# EAGLE design TLE5010 (EAGLE 7.5.0)
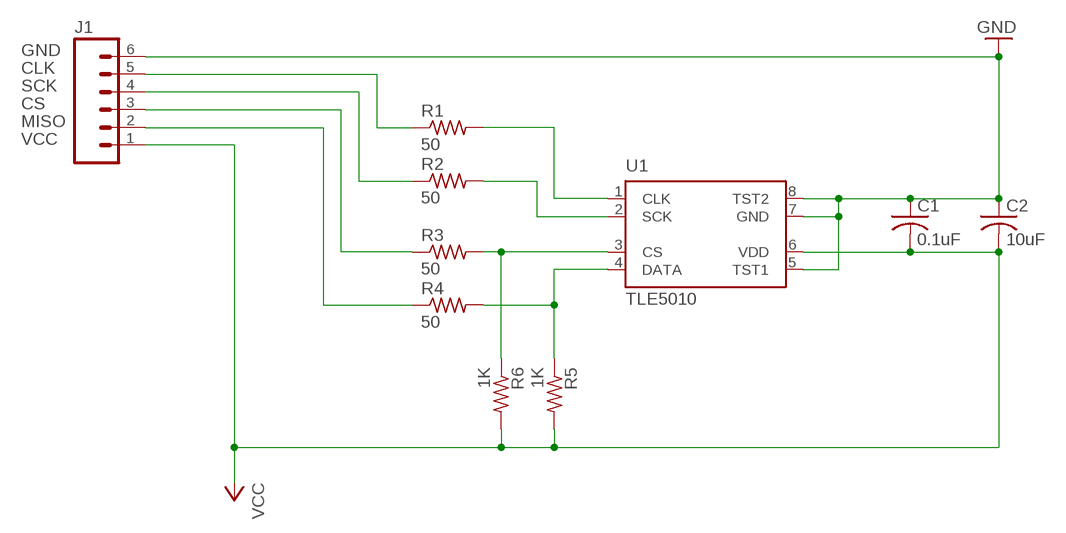
[diagram p0: schematic, sheet 1]

## Parts
C1  0.1uF  C-USC1206  [C1206]
C2  10uF  C-USC1206  [C1206]
J1  M06POLAR_LOCK  [MOLEX-1X6_LOCK]
R1  50  R-US_R1206  [R1206]
R2  50  R-US_R1206  [R1206]
R3  50  R-US_R1206  [R1206]
R4  50  R-US_R1206  [R1206]
R5  1K  R-US_R1206  [R1206]
R6  1K  R-US_R1206  [R1206]
U1  TLE5010  [PG-DSO-8]

## Nets
CLK: J1.5 R1.1
CS: J1.3 R3.1
DATA: R4.2 R5.1 U1.4(DATA)
GND: C1.1 C2.1 J1.6 U1.5(TST1) U1.7(GND) U1.8(TST2)
MISO: J1.2 R4.1
N$1: R1.2 U1.1(CLK)
N$2: R2.2 U1.2(SCK)
N$3: R3.2 R6.1 U1.3(CS)
SCK: J1.4 R2.1
VCC: C1.2 C2.2 J1.1 R5.2 R6.2 U1.6(VDD)

## Library data of the parts
C1 C2 = resistor:C-US: CAPACITOR, American symbol
J1 = SparkFun-Connectors:M06: Header 6 Standard 6-pin 0.1" header. Use with straight break away headers (SKU : PRT-00116), right angle break away headers (PRT-00553), swiss pins (PRT-00743), machine pins (PRT-00117), and female headers (PRT-00115). Molex polarized connector foot print use with SKU : PRT-08094 with associated crimp pins and housings. NOTES ON THE VARIANTS LOCK and LOCK_LONGPADS... This footprint was designed to help hold the alignment of a through-hole component (i.e. 6-pin header) while soldering it into place. You may notice that each hole has been shifted either up or down by 0.005 of an inch from it's more standard position (which is a perfectly straight line). This slight alteration caused the pins (the squares in the middle) to touch the edges of the holes. Because they are alternating, it causes a "brace" to hold the component in place. 0.005 has proven to be the perfect amount of "off-center" position when using our standard breakaway headers. Although looks a little odd when you look at the bare footprint, once you have a header in there, the alteration is very hard to notice. Also,if you push a header all the way into place, it is covered up entirely on the bottom side. This idea of altering the position of holes to aid alignment will be further integrated into the Sparkfun Library for other footprints. It can help hold any component with 3 or more connection pins.
R1-R6 = resistor:R-US_: RESISTOR, American symbol
U1 = infineon:TLE5010: TLE5010 GMR Angular Sensor VDD 5.0V Angle Range 0–360

## Board
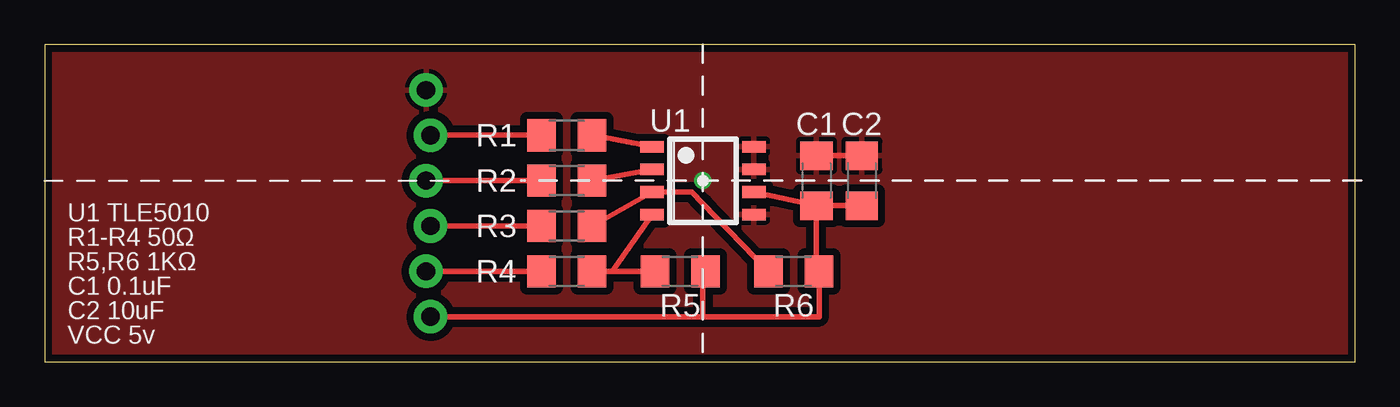
[diagram p1: board, top side]
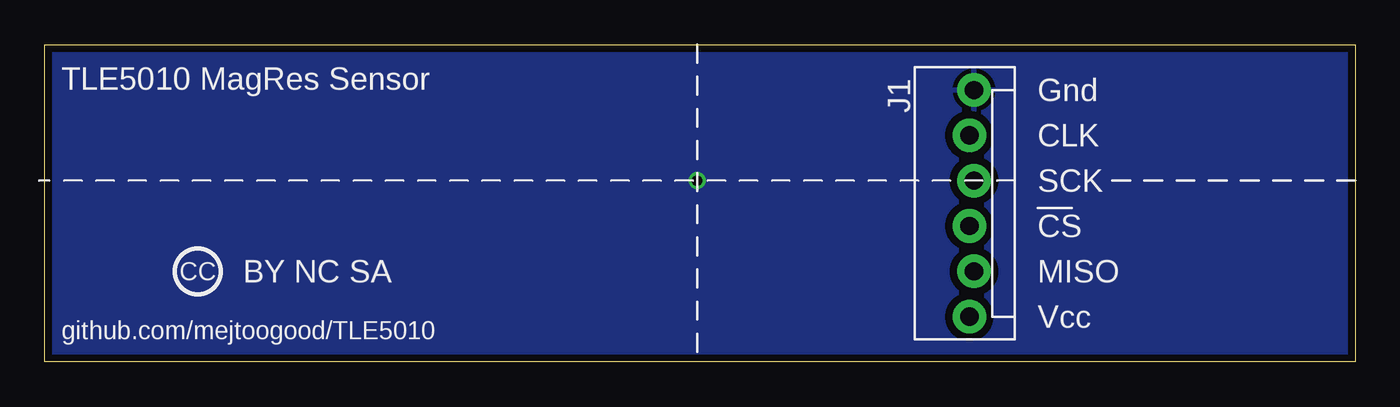
[diagram p2: board, bottom side, seen from below]

Size 73.33 x 17.78 mm. Coordinates in mm from the lower left corner, seen from the top.
Outline: 0,17.77 73.33,17.77 73.33,0 0,0 0,17.78
Copper layers (1*16): Top 0.0356mm / dielectric 1.5011mm / Bottom 0.0356mm
Design rules "OSH Park 2layer": minimum track width 6mil, minimum drill 13mil, track to track 6mil, track to pad 6mil, pad to pad 6mil, via to via 6mil, smd to smd 6mil, copper to edge 15mil, drill to drill 6mil, minimum pad ring 7mil, minimum via ring 7mil, stop-mask expansion 2.5mil, vias tented up to drill 0mil, thermal gap 10mil

### Footprints (pad centres in the part's own frame; a part is rotated, then mirrored left to right if it is on the bottom)
C1206 = smd 1.6 x 1.8: 1 -1.4,0; 2 1.4,0
MOLEX-1X6_LOCK = drill 1.016 pad 1.88: 1 0,0; 2 2.54,-0.254; 3 5.08,0; 4 7.62,-0.254; 5 10.16,0; 6 12.7,-0.254
R1206 = smd 1.6 x 1.803: 1 -1.422,0; 2 1.422,0
PG-DSO-8 = smd 0.65 x 1.31: 1 -1.905,-2.845; 2 -0.635,-2.845; 3 0.635,-2.845; 4 1.905,-2.845; 5 1.905,2.845; 6 0.635,2.845; 7 -0.635,2.845; 8 -1.905,2.845

### Placement (x,y rotation side)
C1  43.18,10.16 270 top
C2  45.72,10.16 270 top
J1  21.59,2.54 90 bottom
R1  29.21,12.7 0 top
R2  29.21,10.16 0 top
R3  29.21,7.62 0 top
R4  29.21,5.08 0 top
R5  35.56,5.08 0 top
R6  41.91,5.08 0 top
U1  36.83,10.16 270 top

### Tracks (layer width: path | path; a pad name or v marks a point on that pad's centre or on a via)
CLK
  Top 0.305: J1.5 R1.1
CS
  Top 0.305: J1.3 R3.1
DATA
  Top 0.305: 33.98,5.23 R5.1 31.75,5.08 | R4.2 31.75,5.08 | U1.4 31.75,5.08
GND  (via drill 0.6)
  Top 0.152: 43.28,11.58 C1.1 | 45.72,11.58 C2.1
  Top 0.305: 43.28,11.58 43.3,11.56 C2.1
  other vias: 36.83,10.16
  pour Top (isolate 0.406): 0,0 0,17.78 73.66,17.78 73.66,0
  pour Bottom (isolate 0.406): 0,0 0,17.78 73.66,17.78 73.66,0
MISO
  Top 0.305: J1.2 R4.1
N$1
  Top 0.305: R1.2 U1.1
N$2
  Top 0.305: R2.2 U1.2
N$3
  Top 0.305: R3.2 U1.3 36.2,9.53 36.83,8.89 R6.1
SCK
  Top 0.305: J1.4 R2.1
VCC
  Top 0.305: C1.2 43.18,5.23 R6.2 43.33,2.54 36.83,2.54 | C1.2 C2.2 | C1.2 U1.6 | R5.2 36.83,5.08 36.83,2.54 | J1.1 36.83,2.54

### Text on the board
tNames: U1 TLE5010 / R1-R4 50Ω / R5,R6 1KΩ / C1 0.1uF / C2 10uF / VCC 5v
bNames: Gnd | TLE5010 MagRes Sensor | CLK | SCK | CS | MISO | BY NC SA | CC | Vcc | github.com/mejtoogood/TLE5010